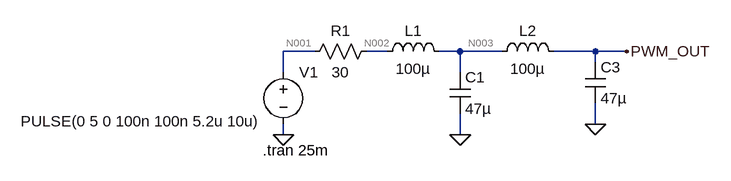
[diagram p0: schematic PWM_Filter.asc]
PWM_Filter.asc, the LTspice schematic file:
Version 4
SHEET 1 880 680
WIRE 112 112 64 112
WIRE 224 112 192 112
WIRE 336 112 304 112
WIRE 400 112 336 112
WIRE 544 112 480 112
WIRE 592 112 544 112
WIRE 544 128 544 112
WIRE 64 144 64 112
WIRE 336 144 336 112
WIRE 544 224 544 192
WIRE 64 240 64 224
WIRE 336 240 336 208
FLAG 336 240 0
FLAG 64 240 0
FLAG 544 224 0
FLAG 592 112 PWM_OUT
SYMBOL res 208 96 R90
WINDOW 0 0 56 VBottom 2
WINDOW 3 32 56 VTop 2
SYMATTR InstName R1
SYMATTR Value 30
SYMBOL ind 208 128 R270
WINDOW 0 32 56 VTop 2
WINDOW 3 5 56 VBottom 2
SYMATTR InstName L1
SYMATTR Value 100µ
SYMATTR SpiceLine Rpar=0.728
SYMBOL cap 320 144 R0
SYMATTR InstName C1
SYMATTR Value 47µ
SYMATTR SpiceLine Rser=0.002
SYMBOL voltage 64 128 R0
WINDOW 3 -404 91 Left 2
WINDOW 123 0 0 Left 0
WINDOW 39 0 0 Left 0
SYMATTR Value PULSE(0 5 0 100n 100n 5.2u 10u)
SYMATTR InstName V1
SYMBOL ind 384 128 R270
WINDOW 0 32 56 VTop 2
WINDOW 3 5 56 VBottom 2
SYMATTR InstName L2
SYMATTR Value 100µ
SYMBOL cap 528 128 R0
SYMATTR InstName C3
SYMATTR Value 47µ
TEXT 32 264 Left 2 !.tran 25m

The netlist it stands for:
* PWM_Filter.asc
R1 N002 N001 30
L1 N002 N003 100µ Rpar=0.728
C1 N003 0 47µ Rser=0.002
V1 N001 0 PULSE(0 5 0 100n 100n 5.2u 10u)
L2 N003 PWM_OUT 100µ
C3 PWM_OUT 0 47µ
.tran 25m
.backanno
.end

* Results of the author's LTspice run, read from the files saved beside the schematic
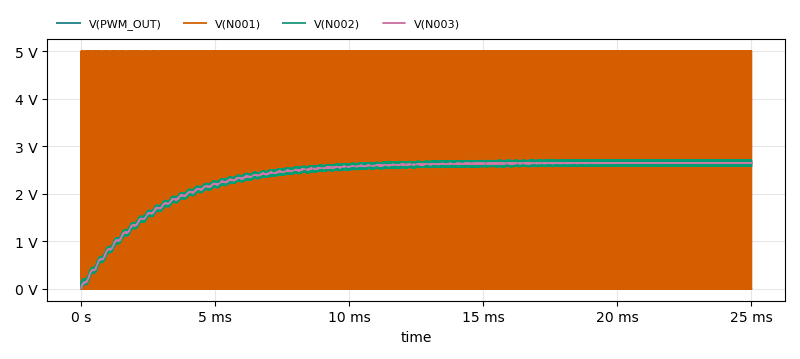
[diagram p1: Transient Analysis of PWM_Filter.asc, plotted from the saved traces]
* Transient Analysis, 1 run:
*   V(PWM_OUT): min 0 V, max 2.65 V, average 2.351 V, rms 2.416 V, last 2.649 V
*   V(N001): min 0 V, max 5 V, average 2.65 V, rms 3.64 V, last 0 V
*   V(N002): min 0 V, max 2.709 V, average 2.351 V, rms 2.416 V, last 2.584 V
*   V(N003): min 0 V, max 2.654 V, average 2.351 V, rms 2.416 V, last 2.645 V